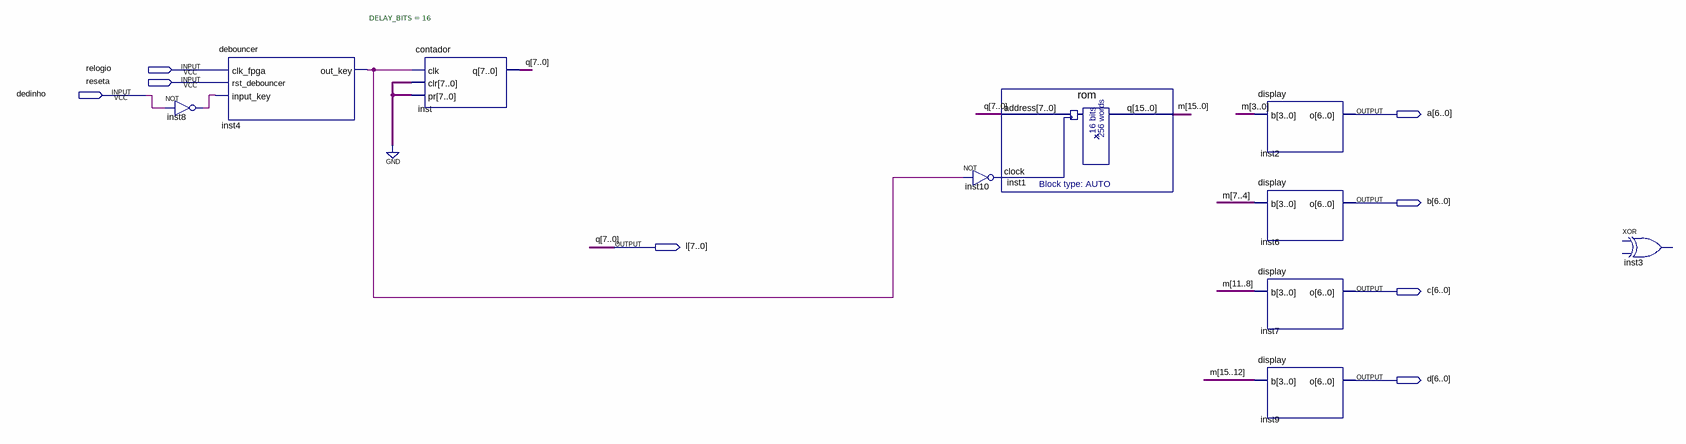
[diagram p0: schematic sheet]
// Quartus schematic rascunho.bdf as structural Verilog: 10 symbols, 8 pins
module rascunho (
  input  relogio,
  input  reseta,
  input  dedinho,
  output [6:0] a,
  output [6:0] b,
  output [7:0] l,
  output [6:0] c,
  output [6:0] d
);

  wire inst4_out_key, inst8_out, inst10_out;
  wire [15:0] m;

  not inst8 (inst8_out, dedinho);
  debouncer #(.DELAY_BITS(16)) inst4 (
    .clk_fpga(relogio), .rst_debouncer(reseta), .input_key(inst8_out), .out_key(inst4_out_key));
  contador inst (.clk(inst4_out_key), .clr({8{1'b0}}), .pr({8{1'b0}}), .q(l));
  not inst10 (inst10_out, inst4_out_key);
  rom inst1 (.address(l), .clock(inst10_out), .q(m));
  display inst2 (.b(m[3:0]), .o(a));
  display inst6 (.b(m[7:4]), .o(b));
  display inst7 (.b(m[11:8]), .o(c));
  display inst9 (.b(m[15:12]), .o(d));
  // XOR inst3 is placed but not wired

  // Other names for the same wires on the sheet: q[7:0] = l
endmodule
